# Altium schematic sheet StEth32_Base_OLED_UserIO.SchDoc
size A4
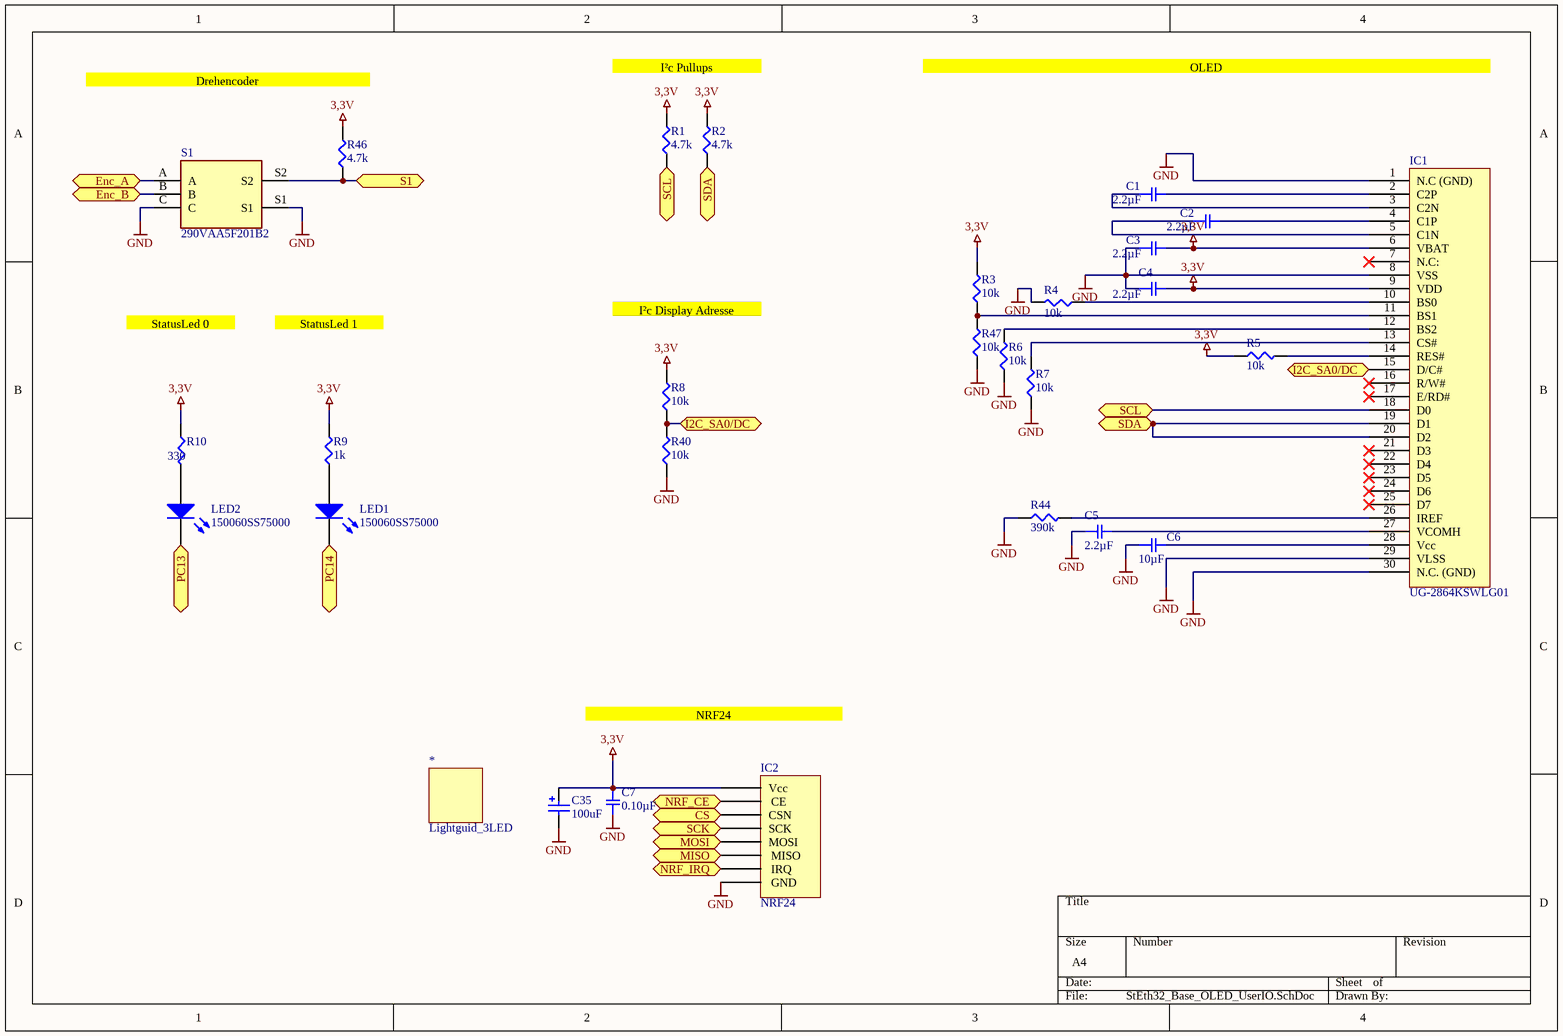
[diagram p0: StEth32_Base_OLED_UserIO.SchDoc]

## Parts
*  Lightguid_3LED  [LightGuid3]
C1  2.2µF  [SMD-0603C]
C2  2.2µF  [SMD-0603C]
C3  2.2µF  [SMD-0603C]
C4  2.2µF  [SMD-0603C]
C5  2.2µF  [SMD-0603C]
C6  10µF  [SMD-0603C]
C7  0.10µF  [SMD-0603C]
C35  value 100uF  [WCAP-ASLI_6.3x5.5]  (hidden comment: 865080243007)
IC1  UG-2864KSWLG01  [UG-2864KSWLG01]
IC2  NRF24  [ML01SP4]
LED1  150060SS75000  [0603_A]
LED2  150060SS75000  [0603_A]
R1  4.7k  [SMD-0603-RES]
R2  4.7k  [SMD-0603-RES]
R3  10k  [SMD-0603-RES]
R4  10k  [SMD-0603-RES]
R5  10k  [SMD-0603-RES]
R6  10k  [SMD-0603-RES]
R7  10k  [SMD-0603-RES]
R8  10k  [SMD-0603-RES]
R9  1k  [SMD-0603-RES]
R10  330  [SMD-0603-RES]
R40  10k  [SMD-0603-RES]
R44  390k  [SMD-0603-RES]
R46  4.7k  [SMD-0603-RES]
R47  10k  [SMD-0603-RES]
S1  290VAA5F201B2  [EC11B]

## Ports
CS (bidir), Enc_A (bidir), Enc_B (bidir), I2C_SA0/DC (bidir), MISO (bidir), MOSI (bidir), NRF_CE (bidir), NRF_IRQ (bidir), PC13 (bidir), PC14 (bidir), S1 (bidir), SCK (bidir), SCL (bidir), SDA (bidir)

## Nets
3,3V: C3.2 C4.2 C7.1 C35.1(P) IC1.6(VBAT) IC1.9(VDD) IC2.Vcc R1.2 R2.2 R3.2 R5.1 R8.2 R9.2 R10.1 R46.2
GND: C3.1 C4.1 C5.1 C6.1 C7.2 C35.2(N) IC1.1(N.C_(GND)) IC1.8(VSS) IC1.29(VLSS) IC1.30(N.C._(GND)) IC2.Gnd(GND) R4.2 R6.1 R7.1 R40.1 R44.1 R47.1 S1.C S1.S1
CS: IC2.CSN ; port CS
Enc_A: S1.A ; port Enc_A
Enc_B: S1.B ; port Enc_B
I2C_SA0/DC: IC1.15(D/C#) R8.1 R40.2 ; port I2C_SA0/DC
MISO: IC2.MISO ; port MISO
MOSI: IC2.MOSI ; port MOSI
NRF_CE: IC2.CE ; port NRF_CE
NRF_IRQ: IC2.IRQ ; port NRF_IRQ
PC13: LED2.1(K) ; port PC13
PC14: LED1.1(K) ; port PC14
S1: R46.1 S1.S2 ; port S1
SCK: IC2.SCK ; port SCK
SCL: IC1.18(D0) R1.1 ; port SCL
SDA: IC1.19(D1) IC1.20(D2) R2.1 ; port SDA
NetC1_1: C1.1 IC1.3(C2N)
NetC1_2: C1.2 IC1.2(C2P)
NetC2_1: C2.1 IC1.5(C1N)
NetC2_2: C2.2 IC1.4(C1P)
NetC5_2: C5.2 IC1.27(VCOMH)
NetC6_2: C6.2 IC1.28(Vcc)
NetIC1_10: IC1.10(BS0) R4.1
NetIC1_11: IC1.11(BS1) R3.1 R47.2
NetIC1_12: IC1.12(BS2) R6.2
NetIC1_13: IC1.13(CS#) R7.2
NetIC1_14: IC1.14(RES#) R5.2
NetIC1_26: IC1.26(IREF) R44.2
NetLED1_2: LED1.2(A) R9.1
NetLED2_2: LED2.2(A) R10.2

Not connected (* = marked no-connect by the designer): IC1 7(N.C:)* 16(R/W#)* 17(E/RD#)* 21(D3)* 22(D4)* 23(D5)* 24(D6)* 25(D7)*

## Notes on the sheet
- Drehencoder
- I²c Pullups
- OLED
- I²c Display Adresse
- StatusLed 0
- StatusLed 1
- NRF24

## Library data of the parts
* = Lightguid_3LED: Lichtleiter 3Dach 90°
C1-C5 = GRM188C81C225KA12D: CAP CER 2.2UF 16V X6S 0603; Manufacturer: Murata Electronics North America; Factory Stock: 0; Unit Price (USD): 0.2; Minimum Quantity: 1; Tolerance: ±10%; Datasheets: http://www.murata.com/~/media/webrenewal/support/library/catalog/products/capacitor/mlcc/c02e.pdf; Image: //media.digikey.com/Renders/Murata%20Renders/ZRB-SERIES-0402.jpg; Digi-Key Part Number: 490-11993-1-ND; Part Number: GRM188C81C225KA12D; Quantity Available: 1215; @ qty: 0; Packaging: Cut Tape (CT); Series: GRM; Part Status: Active; Value: 2.2µF; Voltage: 16V; Temperature Coefficient: X6S; Operating Temperature: -55°C ~ 105°C; Features: -; Ratings: -; Applications: General Purpose; Mounting Type: Surface Mount, MLCC; Package / Case: 0603 (1608 Metric); Size / Dimension: 0.063" L x 0.031" W (1.60mm x 0.80mm); Height - Seated (Max): -; Thickness (Max): 0.035" (0.90mm); Lead Spacing: -; Lead Style: -
C6 = GRM185R60J106ME15D: CAP CER 10UF 6.3V X5R 0603; Manufacturer: Murata Electronics North America; Factory Stock: 0; Unit Price (USD): 0.36; Minimum Quantity: 1; Tolerance: ±20%; Datasheets: http://www.murata.com/~/media/webrenewal/support/library/catalog/products/capacitor/mlcc/c02e.pdf; Image: //media.digikey.com/Renders/Murata%20Renders/ZRB-SERIES-0402.jpg; Digi-Key Part Number: 490-10467-1-ND; Part Number: GRM185R60J106ME15D; Quantity Available: 25068; @ qty: 0; Packaging: Cut Tape (CT); Series: GRM; Part Status: Active; Value: 10µF; Voltage: 6.3V; Temperature Coefficient: X5R; Operating Temperature: -55°C ~ 85°C; Features: Derating Recommended; Ratings: -; Applications: General Purpose; Mounting Type: Surface Mount, MLCC; Package / Case: 0603 (1608 Metric); Size / Dimension: 0.063" L x 0.031" W (1.60mm x 0.80mm); Height - Seated (Max): -; Thickness (Max): 0.022" (0.55mm); Lead Spacing: -; Lead Style: -
C7 = GCM188R71C104KA37J: CAP CER 0.1UF 16V X7R 0603; Manufacturer: Murata Electronics North America; Factory Stock: 0; Unit Price (USD): 0.18; Minimum Quantity: 1; Tolerance: ±10%; Datasheets: http://www.murata.com/~/media/webrenewal/support/library/catalog/products/capacitor/mlcc/c03e.ashx; Image: //media.digikey.com/Renders/Murata%20Renders/0603%28GCM188%29.jpg; Digi-Key Part Number: 490-8015-1-ND; Part Number: GCM188R71C104KA37J; Quantity Available: 17844; @ qty: 0; Packaging: Cut Tape (CT); Series: GCM; Part Status: Active; Value: 0.10µF; Voltage: 16V; Temperature Coefficient: X7R; Operating Temperature: -55°C ~ 125°C; Features: -; Ratings: AEC-Q200; Applications: Automotive; Mounting Type: Surface Mount, MLCC; Package / Case: 0603 (1608 Metric); Size / Dimension: 0.063" L x 0.031" W (1.60mm x 0.80mm); Height - Seated (Max): -; Thickness (Max): 0.035" (0.90mm); Lead Spacing: -; Lead Style: -
C35 = 865080243007: WCAP-ASLI Aluminum Electrolytic Capacitors, size Ф6.3x5.5mm, 10V DC, 100uF; Rated Voltage: 10V DC; ComponentLink1Description: Manufacturer; ComponentLink1URL: http://www.we-online.de; ComponentLink2Description: Datasheet; ComponentLink2URL: http://katalog.we-online.de/pbs/datasheet/865080243007.pdf; Part Number: 865080243007; Published Date: June 2017; Publisher: Wurth Elektronik; Size: Ф6.3x5.5mm; Life Cycle: 2000h; Operating Temperature: -55 °C up to +105 °C
IC1 = UG-2864KSWLG01: OLED 1,3" 128x64
LED1 LED2 = 150060SS75000: SMD mono-color Chip LED, WL-SMCW, Super Red; PackageReference: 0603_A; Color: Super Red; PartNumber: 150060SS75000; ComponentLink1Description: Manufacturer URL; ComponentLink1URL: http://www.we-online.com; ComponentLink2Description: Datasheet; ComponentLink2URL: http://katalog.we-online.com/led/datasheet/150060SS75000.pdf
R1 R2 R46 = ERJ-PA3F4701V: RES SMD 4.7K OHM 1% 1/4W 0603; Manufacturer: Panasonic Electronic Components; Factory Stock: 0; Unit Price (USD): 0.02372; @ qty: 1500; Minimum Quantity: 1; Power (Watts): 0.25W, 1/4W; Temperature Coefficient: ±100ppm/°C; Part Number: ERJ-PA3F4701V; Datasheets: https://industrial.panasonic.com/cdbs/www-data/pdf/RDA0000/AOA0000C243.pdf; Image: //media.digikey.com/Photos/Panasonic%20Photos/MFG_ERJ-P6W%20Series.jpg; Digi-Key Part Number: P4.7KBYCT-ND; Quantity Available: 14801; Packaging: Cut Tape (CT); Series: ERJ; Part Status: Active; Value: 4.7k; Tolerance: ±1%; Composition: Thick Film; Features: Automotive AEC-Q200, Pulse Withstanding; Operating Temperature: -55°C ~ 155°C; Package / Case: 0603 (1608 Metric); Supplier Device Package: 0603; Size / Dimension: 0.063" L x 0.031" W (1.60mm x 0.80mm); Height - Seated (Max): 0.022" (0.55mm); Number of Terminations: 2; Failure Rate: -
R3-R8 R40 R47 = ERJ-3EKF1002V: RES SMD 10K OHM 1% 1/10W 0603; Manufacturer: Panasonic Electronic Components; Factory Stock: 0; Unit Price (USD): 0.00379; @ qty: 1500; Minimum Quantity: 1; Power (Watts): 0.1W, 1/10W; Temperature Coefficient: ±100ppm/°C; Part Number: ERJ-3EKF1002V; Datasheets: http://industrial.panasonic.com/www-cgi/jvcr13pz.cgi?E+PZ+3+AOA0002+ERJ3EKF1002V+7+WW; Image: //media.digikey.com/Photos/Panasonic%20Photos/MFG_ERJ-P6W%20Series.jpg; Digi-Key Part Number: P10.0KHCT-ND; Quantity Available: 6703141; Packaging: Cut Tape (CT); Series: ERJ; Part Status: Active; Value: 10k; Tolerance: ±1%; Composition: Thick Film; Features: Automotive AEC-Q200; Operating Temperature: -55°C ~ 155°C; Package / Case: 0603 (1608 Metric); Supplier Device Package: 0603; Size / Dimension: 0.063" L x 0.031" W (1.60mm x 0.80mm); Height - Seated (Max): 0.022" (0.55mm); Number of Terminations: 2; Failure Rate: -
R9 = ERJ-3EKF1001V: RES SMD 1K OHM 1% 1/10W 0603; Manufacturer: Panasonic Electronic Components; Factory Stock: 0; Unit Price (USD): 0.00379; @ qty: 1500; Minimum Quantity: 1; Power (Watts): 0.1W, 1/10W; Temperature Coefficient: ±100ppm/°C; Part Number: ERJ-3EKF1001V; Datasheets: http://industrial.panasonic.com/www-cgi/jvcr13pz.cgi?E+PZ+3+AOA0002+ERJ3EKF1001V+7+WW; Image: //media.digikey.com/Photos/Panasonic%20Photos/MFG_ERJ-P6W%20Series.jpg; Digi-Key Part Number: P1.00KHCT-ND; Quantity Available: 5218845; Packaging: Cut Tape (CT); Series: ERJ; Part Status: Active; Value: 1k; Tolerance: ±1%; Composition: Thick Film; Features: Automotive AEC-Q200; Operating Temperature: -55°C ~ 155°C; Package / Case: 0603 (1608 Metric); Supplier Device Package: 0603; Size / Dimension: 0.063" L x 0.031" W (1.60mm x 0.80mm); Height - Seated (Max): 0.022" (0.55mm); Number of Terminations: 2; Failure Rate: -
R10 = ERJ-3EKF3300V: RES SMD 330 OHM 1% 1/10W 0603; Manufacturer: Panasonic Electronic Components; Factory Stock: 0; Unit Price (USD): 0.00379; @ qty: 1500; Minimum Quantity: 1; Power (Watts): 0.1W, 1/10W; Temperature Coefficient: ±100ppm/°C; Part Number: ERJ-3EKF3300V; Datasheets: http://industrial.panasonic.com/www-cgi/jvcr13pz.cgi?E+PZ+3+AOA0002+ERJ3EKF3300V+7+WW; Image: //media.digikey.com/Photos/Panasonic%20Photos/MFG_ERJ-P6W%20Series.jpg; Digi-Key Part Number: P330HCT-ND; Quantity Available: 670984; Packaging: Cut Tape (CT); Series: ERJ; Part Status: Active; Value: 330; Tolerance: ±1%; Composition: Thick Film; Features: Automotive AEC-Q200; Operating Temperature: -55°C ~ 155°C; Package / Case: 0603 (1608 Metric); Supplier Device Package: 0603; Size / Dimension: 0.063" L x 0.031" W (1.60mm x 0.80mm); Height - Seated (Max): 0.022" (0.55mm); Number of Terminations: 2; Failure Rate: -
R44 = ERJ-3EKF3903V: RES SMD 390K OHM 1% 1/10W 0603; Manufacturer: Panasonic Electronic Components; Factory Stock: 0; Unit Price (USD): 0.00379; @ qty: 1500; Minimum Quantity: 1; Power (Watts): 0.1W, 1/10W; Temperature Coefficient: ±100ppm/°C; Part Number: ERJ-3EKF3903V; Datasheets: http://industrial.panasonic.com/www-cgi/jvcr13pz.cgi?E+PZ+3+AOA0002+ERJ3EKF3903V+7+WW; Image: //media.digikey.com/Photos/Panasonic%20Photos/MFG_ERJ-P6W%20Series.jpg; Digi-Key Part Number: P390KHCT-ND; Quantity Available: 25618; Packaging: Cut Tape (CT); Series: ERJ; Part Status: Active; Value: 390k; Tolerance: ±1%; Composition: Thick Film; Features: Automotive AEC-Q200; Operating Temperature: -55°C ~ 155°C; Package / Case: 0603 (1608 Metric); Supplier Device Package: 0603; Size / Dimension: 0.063" L x 0.031" W (1.60mm x 0.80mm); Height - Seated (Max): 0.022" (0.55mm); Number of Terminations: 2; Failure Rate: -
S1 = 290VAA5F201B2: Switch; Manufacturer_Name: CTS; Datasheet Link: https://www.mouser.com/datasheet/2/96/290-1138413.pdf; Height: 26.7mm; Manufacturer_Part_Number: 290VAA5F201B2; Mouser Part Number: 774-290VAA5F201B2; Mouser Price/Stock: https://www.mouser.com/Search/Refine.aspx?Keyword=774-290VAA5F201B2; RS Part Number: 1774359; RS Price/Stock: http://uk.rs-online.com/web/p/products/1774359